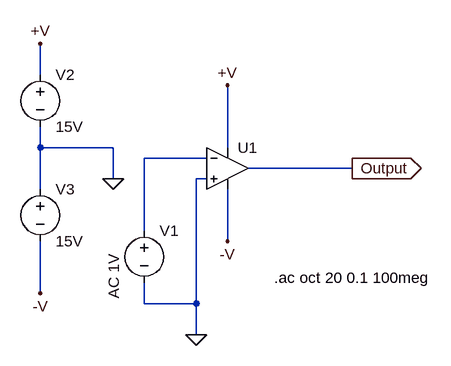
[diagram p0: schematic 25.1_5.(2).asc]
25.1_5.(2).asc, the LTspice schematic file:
Version 4
SHEET 1 880 680
WIRE -64 48 -64 0
WIRE -64 160 -64 128
WIRE 48 160 -64 160
WIRE 224 160 224 64
WIRE 192 176 96 176
WIRE 416 192 256 192
WIRE 48 208 48 160
WIRE 192 208 176 208
WIRE -64 224 -64 160
WIRE 96 288 96 176
WIRE 224 304 224 224
WIRE -64 384 -64 304
WIRE 96 400 96 368
WIRE 176 400 176 208
WIRE 176 400 96 400
WIRE 176 448 176 400
FLAG 416 192 Output
IOPIN 416 192 Out
FLAG 176 448 0
FLAG -64 0 +V
FLAG 224 64 +V
FLAG -64 384 -V
FLAG 224 304 -V
FLAG 48 208 0
SYMBOL Opamps\\UniversalOpamp2 224 192 R0
SYMATTR InstName U1
SYMBOL voltage -64 32 R0
WINDOW 123 0 0 Left 2
WINDOW 39 0 0 Left 2
SYMATTR InstName V2
SYMATTR Value 15V
SYMBOL voltage -64 208 R0
WINDOW 123 0 0 Left 2
WINDOW 39 0 0 Left 2
SYMATTR InstName V3
SYMATTR Value 15V
SYMBOL voltage 96 272 R0
WINDOW 123 -47 121 VLeft 2
WINDOW 39 0 0 Left 2
SYMATTR Value2 AC 1V
SYMATTR InstName V1
SYMATTR Value ""
TEXT 296 360 Left 2 !.ac oct 20 0.1 100meg

The netlist it stands for:
* 25.1_5.(2).asc
XU1 0 N001 +V -V Output level.2 Avol=1Meg GBW=10Meg Slew=10Meg ilimit=25m rail=0 Vos=0 phimargin=45 en=0 enk=0 in=0 ink=0 Rin=500Meg  ; pins IN+ IN- V+ V- OUT
V2 +V 0 15V
V3 0 -V 15V
V1 N001 0 AC 1V
.ac oct 20 0.1 100meg
.lib UniversalOpamps2.sub
.backanno
.end

* Results of the author's LTspice run, read from the files saved beside the schematic
* Operating Point, zero values left out:
*   V(+v) = 15 V
*   V(-v) = -15 V
*   I(V3) = -1.498 mA
*   I(V2) = -1.498 mA
*   Ix(u1:3) = 1.498 mA
*   Ix(u1:4) = -1.498 mA
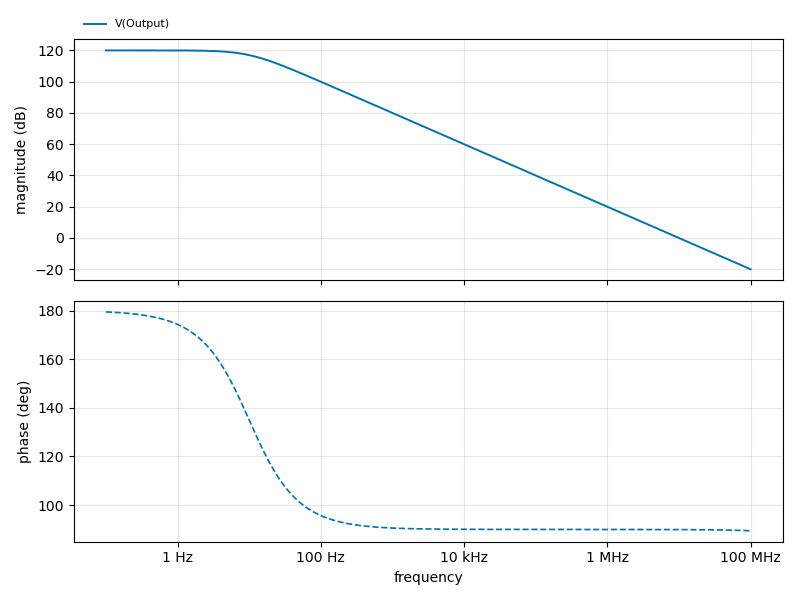
[diagram p1: AC Analysis of 25.1_5.(2).asc, plotted from the saved traces]
* AC Analysis, 1 run:
*   V(Output): 119.99 dB at 100 mHz, -20.01 dB at 100 MHz, peak 119.99 dB at 100 mHz, 3 dB below the peak at 10 Hz